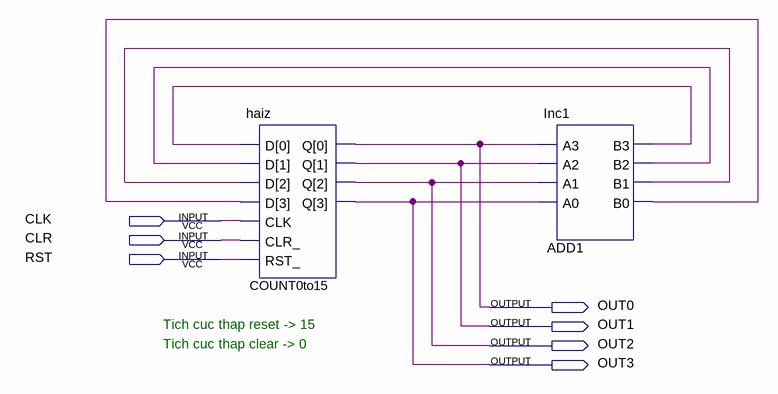
[diagram p0: schematic sheet]
// Quartus schematic Block2.bdf as structural Verilog: 2 symbols, 7 pins
module Block2 (
  input  CLK,
  input  CLR,
  input  RST,
  output OUT0,
  output OUT1,
  output OUT2,
  output OUT3
);

  wire ADD1_b0, ADD1_b1, ADD1_b2, ADD1_b3;

  haiz COUNT0to15 (
    .D({ADD1_b0, ADD1_b1, ADD1_b2, ADD1_b3}), .CLK(CLK), .CLR_(CLR), .RST_(RST), .Q({OUT3, OUT2, OUT1, OUT0}));
  Inc1 ADD1 (.A3(OUT0), .A2(OUT1), .A1(OUT2), .A0(OUT3), .B3(ADD1_b3), .B2(ADD1_b2), .B1(ADD1_b1), .B0(ADD1_b0));

  // Notes on the sheet:
  //   Tich cuc thap reset -> 15
  //   Tich cuc thap clear -> 0
endmodule
